# Altium schematic sheet KEY.SchDoc
size A3; Organization: Altium Limited; Address1: L3, 12a Rodborough Rd; Address2: Frenchs Forest; Address3: NSW; Address4: Australia 2086
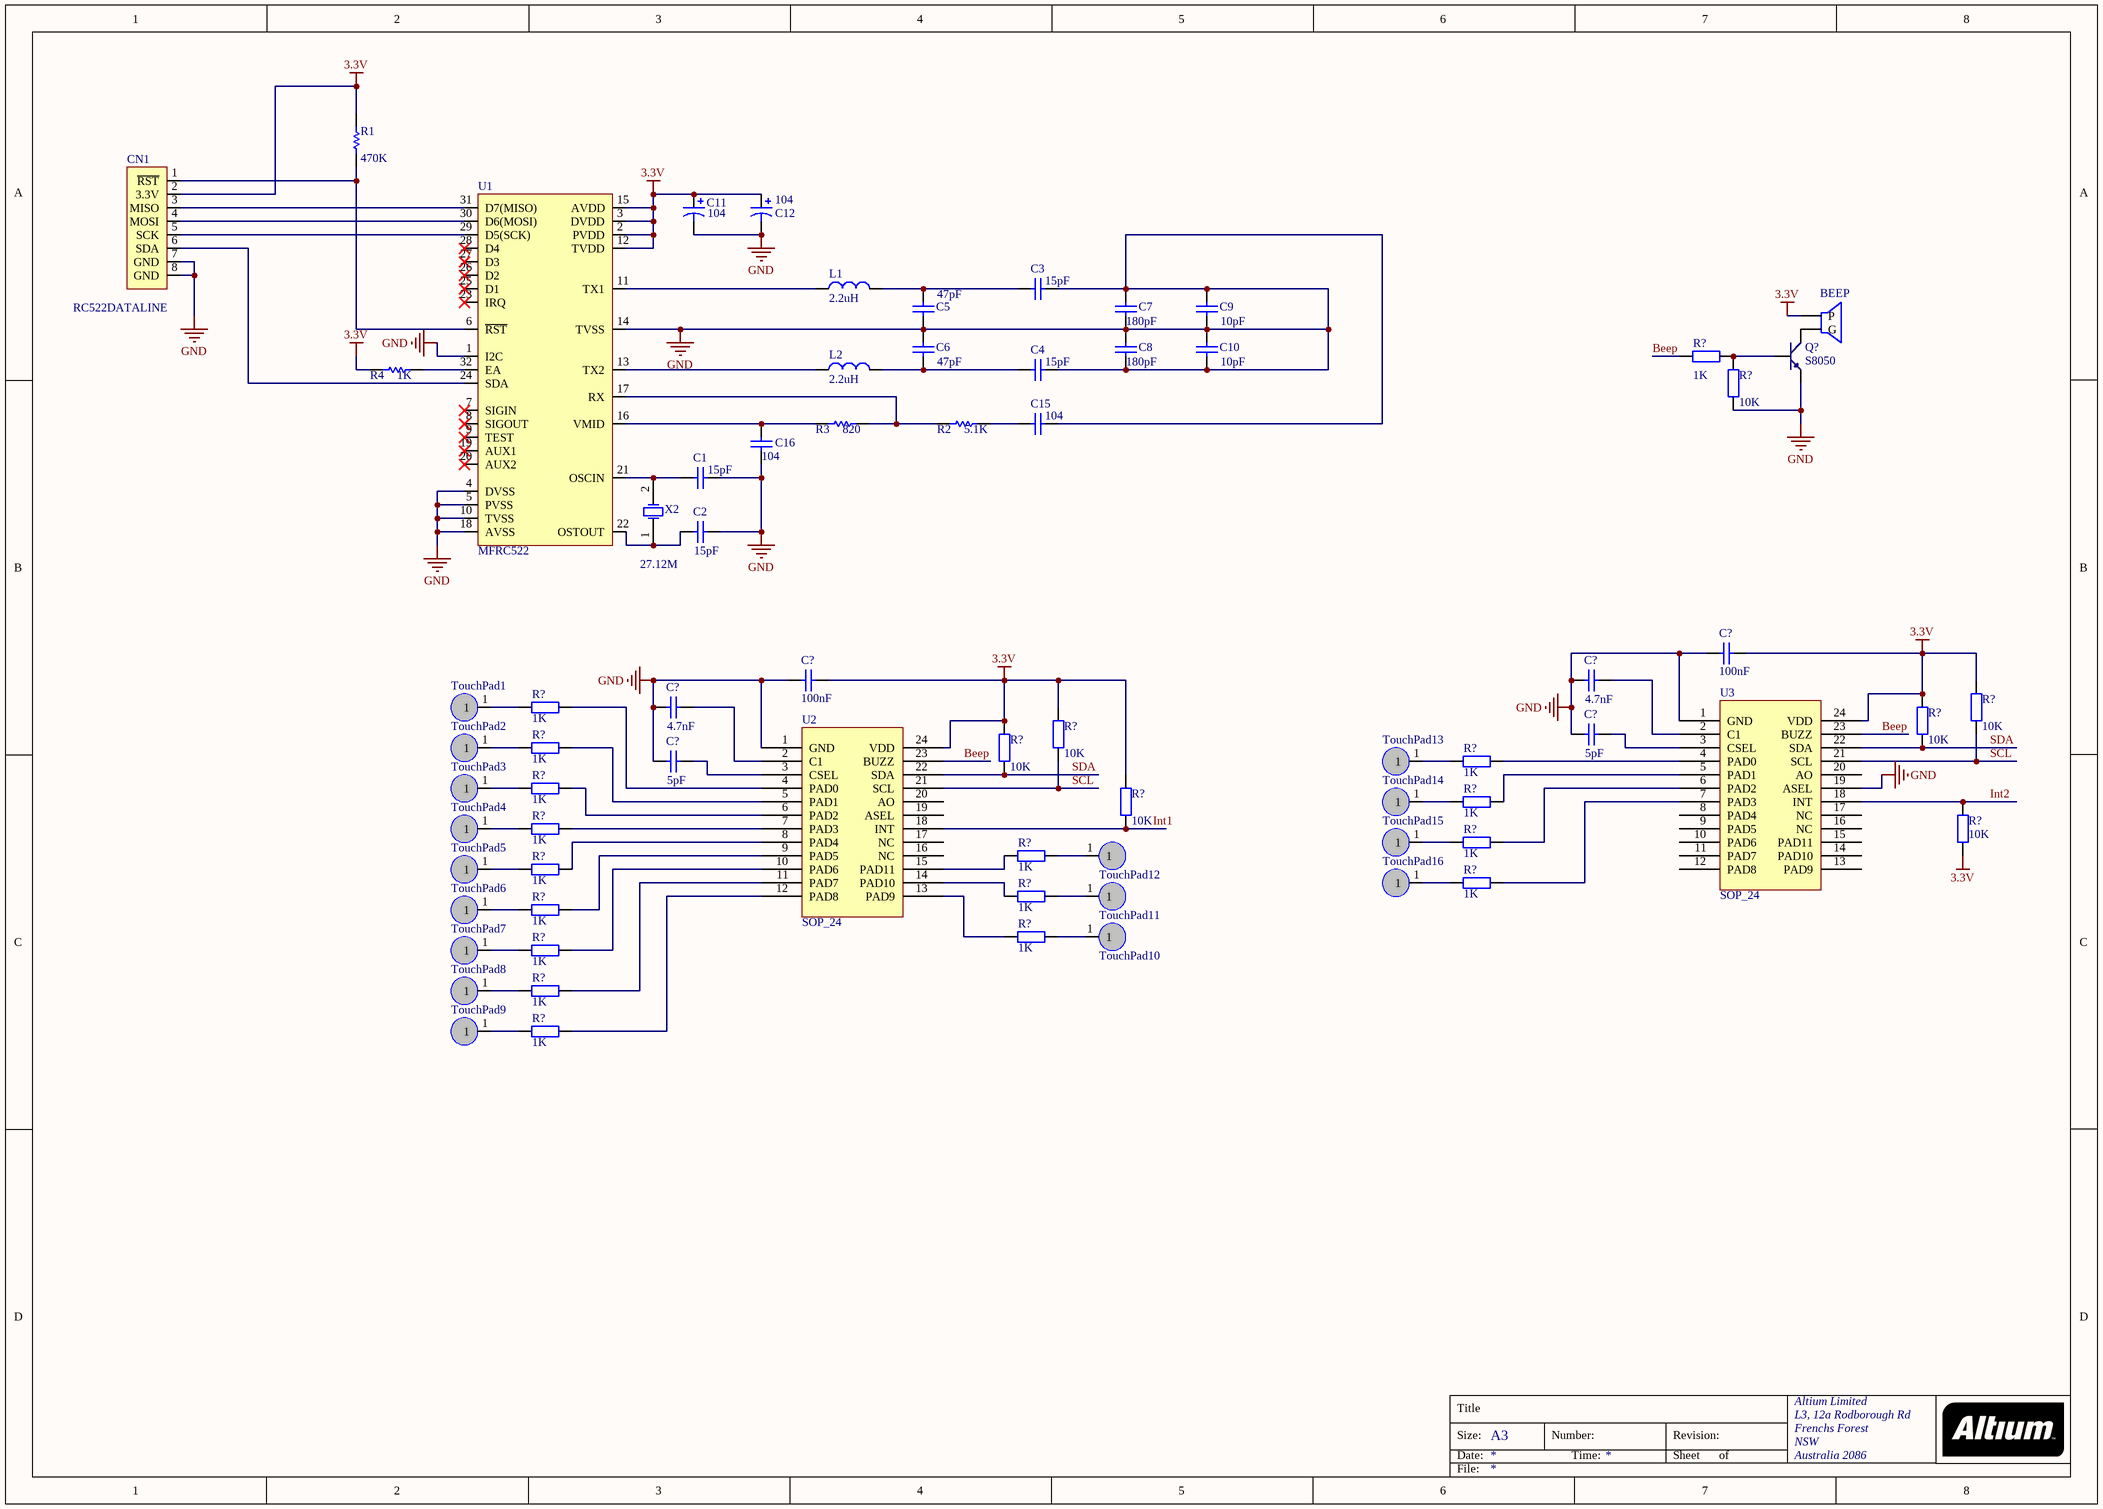
[diagram p0: KEY.SchDoc]

## Parts
(Parts that share a designator on the sheet are numbered #1, #2 ... from top to bottom, then left to right.)
BEEP  BEEP  [BELL-5]  (value not drawn)
C1  15pF  [BC1]
C2  15pF  [BC1]
C3  15pF  [BC1]
C4  15pF  [BC1]
C5  47pF  [BC1]
C6  47pF  [BC1]
C7  180pF  [BC1]
C8  180pF  [BC1]
C9  10pF  [BC1]
C10  10pF  [BC1]
C11  value 104  [BC1]  (hidden comment: 100n)
C12  104  [BC1]
C15  value 104  [BC1]  (hidden comment: 100nF)
C16  value 104  [BC1]  (hidden comment: 100nF)
C?#1  100nF  [0603]
C?#2  100nF  [0603]
C?#3  4.7nF  [0603]
C?#4  4.7nF  [0603]
C?#5  5pF  [0603]
C?#6  5pF  [0603]
CN1  RC522DATALINE  [RC522DATALING]
L1  2.2uH  [1210]
L2  2.2uH  [1210]
Q?  S8050  [SOT-23R]
R1  470K  [BR]
R2  5.1K  [BR]
R3  820  [BR]
R4  1k  [BR]
R?#1  1K  [0603]
R?#2  10K  [0603]
R?#3  1k  [0603]
R?#4  10K  [0603]
R?#5  1k  [0603]
R?#6  10K  [0603]
R?#7  10K  [0603]
R?#8  1k  [0603]
R?#9  10K  [0603]
R?#10  1k  [0603]
R?#11  1k  [0603]
R?#12  1k  [0603]
R?#13  10K  [0603]
R?#14  10K  [0603]
R?#15  1k  [0603]
R?#16  1k  [0603]
R?#17  1k  [0603]
R?#18  1k  [0603]
R?#19  1k  [0603]
R?#20  1k  [0603]
R?#21  1k  [0603]
R?#22  1k  [0603]
R?#23  1k  [0603]
R?#24  1k  [0603]
TouchPad1  TouchPad  (value not drawn)
TouchPad2  TouchPad  (value not drawn)
TouchPad3  TouchPad  (value not drawn)
TouchPad4  TouchPad  (value not drawn)
TouchPad5  TouchPad  (value not drawn)
TouchPad6  TouchPad  (value not drawn)
TouchPad7  TouchPad  (value not drawn)
TouchPad8  TouchPad  (value not drawn)
TouchPad9  TouchPad  (value not drawn)
TouchPad10  TouchPad  (value not drawn)
TouchPad11  TouchPad  (value not drawn)
TouchPad12  TouchPad  (value not drawn)
TouchPad13  TouchPad  (value not drawn)
TouchPad14  TouchPad  (value not drawn)
TouchPad15  TouchPad  (value not drawn)
TouchPad16  TouchPad  (value not drawn)
U1  MFRC522  [QFN32]
U2  SOP_24  [SOP24]
U3  SOP_24  [SOP24]
X2  27.12M  [CRYSTAL]

## Nets
3.3V: BEEP.1(P) C11.1 C12.1 C?#1.2 C?#2.2 CN1.2(3.3V) R1.2 R4.1 R?#4.2 R?#6.2 R?#7.2 R?#9.2 R?#13.2 R?#14.2 U1.2(PVDD) U1.3(DVDD) U1.12(TVDD) U1.15(AVDD) U2.24(VDD) U3.24(VDD)
GND: C1.1 C2.1 C3.1 C4.1 C5.1 C6.2 C7.1 C7.2 C8.1 C8.2 C9.1 C9.2 C10.1 C10.2 C11.2 C12.2 C15.1 C16.1 C?#1.1 C?#2.1 C?#3.1 C?#4.1 C?#5.1 C?#6.1 CN1.7(GND) CN1.8(GND) Q?.1(E) R?#2.1 U1.1(I2C) U1.4(DVSS) U1.5(PVSS) U1.10(TVSS) U1.14(TVSS) U1.18(AVSS) U2.1(GND) U3.1(GND) U3.19(ASEL)
Beep: R?#1.2 U2.23(BUZZ) U3.23(BUZZ)
Int1: R?#13.1 U2.18(INT)
Int2: R?#14.1 U3.18(INT)
SCL: R?#4.1 R?#7.1 U2.21(SCL) U3.21(SCL)
SDA: R?#6.1 R?#9.1 U2.22(SDA) U3.22(SDA)
NetBEEP_2: BEEP.2(G) Q?.3(C)
NetC1_2: C1.2 U1.21(OSCIN) X2.2(OSC2)
NetC2_2: C2.2 U1.22(OSTOUT) X2.1(OSC1)
NetC3_2: C3.2 C5.2 L1.2
NetC4_2: C4.2 C6.1 L2.2
NetC15_2: C15.2 R2.2
NetC16_2: C16.2 R3.1 U1.16(VMID)
NetC?#3_2: C?#3.2 U3.2(C1)
NetC?#4_2: C?#4.2 U2.2(C1)
NetC?#5_2: C?#5.2 U3.3(CSEL)
NetC?#6_2: C?#6.2 U2.3(CSEL)
NetCN1_1: CN1.1(~{RST}) R1.1 U1.6(~{RST})
NetCN1_3: CN1.3(MISO) U1.31(D7(MISO))
NetCN1_4: CN1.4(MOSI) U1.30(D6(MOSI))
NetCN1_5: CN1.5(SCK) U1.29(D5(SCK))
NetCN1_6: CN1.6(SDA) U1.24(SDA)
NetL1_1: L1.1 U1.11(TX1)
NetL2_1: L2.1 U1.13(TX2)
NetQ?_2: Q?.2(B) R?#1.1 R?#2.2
NetR2_1: R2.1 R3.2 U1.17(RX)
NetR4_2: R4.2 U1.32(EA)
NetR?#3_1: R?#3.1 TouchPad1.1
NetR?#3_2: R?#3.2 U2.4(PAD0)
NetR?#5_1: R?#5.1 TouchPad2.1
NetR?#5_2: R?#5.2 U2.5(PAD1)
NetR?#8_1: R?#8.1 TouchPad13.1
NetR?#8_2: R?#8.2 U3.4(PAD0)
NetR?#10_1: R?#10.1 TouchPad3.1
NetR?#10_2: R?#10.2 U2.6(PAD2)
NetR?#11_1: R?#11.1 TouchPad14.1
NetR?#11_2: R?#11.2 U3.5(PAD1)
NetR?#12_1: R?#12.1 TouchPad4.1
NetR?#12_2: R?#12.2 U2.7(PAD3)
NetR?#15_1: R?#15.1 TouchPad15.1
NetR?#15_2: R?#15.2 U3.6(PAD2)
NetR?#16_1: R?#16.1 TouchPad5.1
NetR?#16_2: R?#16.2 U2.8(PAD4)
NetR?#17_1: R?#17.1 TouchPad12.1
NetR?#17_2: R?#17.2 U2.15(PAD11)
NetR?#18_1: R?#18.1 TouchPad16.1
NetR?#18_2: R?#18.2 U3.7(PAD3)
NetR?#19_1: R?#19.1 TouchPad6.1
NetR?#19_2: R?#19.2 U2.9(PAD5)
NetR?#20_1: R?#20.1 TouchPad11.1
NetR?#20_2: R?#20.2 U2.14(PAD10)
NetR?#21_1: R?#21.1 TouchPad7.1
NetR?#21_2: R?#21.2 U2.10(PAD6)
NetR?#22_1: R?#22.1 TouchPad10.1
NetR?#22_2: R?#22.2 U2.13(PAD9)
NetR?#23_1: R?#23.1 TouchPad8.1
NetR?#23_2: R?#23.2 U2.11(PAD7)
NetR?#24_1: R?#24.1 TouchPad9.1
NetR?#24_2: R?#24.2 U2.12(PAD8)

Not connected (* = marked no-connect by the designer): U1 7(SIGIN)* 8(SIGOUT)* 9(TEST)* 19(AUX1)* 20(AUX2)* 23(IRQ)* 25(D1)* 26(D2)* 27(D3)* 28(D4)*; U2 16(NC) 17(NC) 19(ASEL) 20(AO); U3 8(PAD4) 9(PAD5) 10(PAD6) 11(PAD7) 12(PAD8) 13(PAD9) 14(PAD10) 15(PAD11) 16(NC) 17(NC) 20(AO)

## Notes on the sheet
- Title
- Size:
- Date:
- A3
- Number:
- Time:
- Revision:
- Sheet
- of
- File:

## Library data of the parts
C1-C4 C6-C10 C15 C16 C?#1-C?#6 = Cap: Capacitor; Published: 8-Jun-2000; LatestRevisionDate: 17-Jul-2002; LatestRevisionNote: Re-released for DXP Platform.; PackageReference: RAD-0.3; Publisher: Altium Limited
  C1-C4: PackageDescription: Radial Cap, Thru-Hole; 2 Leads; 0.3 in Pin Spacing; Value: 15pF
  C6: PackageDescription: Radial Cap, Thru-Hole; 2 Leads; 0.3 in Pin Spacing; Value: 47pF
  C7 C8: PackageDescription: Radial Cap, Thru-Hole; 2 Leads; 0.3 in Pin Spacing; Value: 180pF
  C9 C10: PackageDescription: Radial Cap, Thru-Hole; 2 Leads; 0.3 in Pin Spacing; Value: 10pF
  C15 C16: PackageDescription: Radial Cap, Thru-Hole; 2 Leads; 0.3 in Pin Spacing
  C?#1 C?#2: Value: 100nF
  C?#3 C?#4: Value: 4.7nF
  C?#5 C?#6: Value: 5pF
C5 = Cap: 0.1; Published: 8-Jun-2000; LatestRevisionDate: 17-Jul-2002; LatestRevisionNote: Re-released for DXP Platform.; PackageReference: RAD-0.3; Publisher: Altium Limited; PackageDescription: Radial Cap, Thru-Hole; 2 Leads; 0.3 in Pin Spacing; Value: 47pF
C11 C12 = Cap Pol3: Polarized Capacitor (Surface Mount); Published: 8-Jun-2000; LatestRevisionDate: 29-May-2009; LatestRevisionNote: IPC-7351 Footprint Added.; PackageReference: C0805; Publisher: Altium Limited; PackageDescription: Chip Capacitor
  C12: Value: 104
L1 L2 = INDUCTANCE
Q? = NPN: 8050/BCW846/BCW847
R1-R4 = Res1: Resistor; Published: 8-Jun-2000; LatestRevisionDate: 17-Jul-2002; LatestRevisionNote: Re-released for DXP Platform.; PackageReference: AXIAL-0.3; Publisher: Altium Limited; PackageDescription: Axial Device, Thru-Hole; 2 Leads; 0.3 in Pin Spacing
  R1: Value: 470K
  R2: Value: 5.1K
  R3: Value: 820
  R4: Value: 1K
R?#1-R?#24 = Res2: Resistor; Published: 8-Jun-2000; LatestRevisionDate: 17-Jul-2002; LatestRevisionNote: Re-released for DXP Platform.; PackageReference: AXIAL-0.4; Publisher: Altium Limited
  R?#1 R?#3 R?#5 R?#8 R?#10-R?#12 R?#15-R?#24: Value: 1K
  R?#2 R?#4 R?#6 R?#7 R?#9 R?#13 R?#14: Value: 10K
U2 U3 = SOP_24L
X2 = XTAL: Crystal Oscillator; Published: 8-Jun-2000; LatestRevisionDate: 17-Jul-2002; LatestRevisionNote: Re-released for DXP Platform.; PackageReference: R38; Publisher: Altium Limited; PackageDescription: Crystal, Thru-Hole; 2 Leads; Body 3.1 x 8.2 mm (Dia.xH)